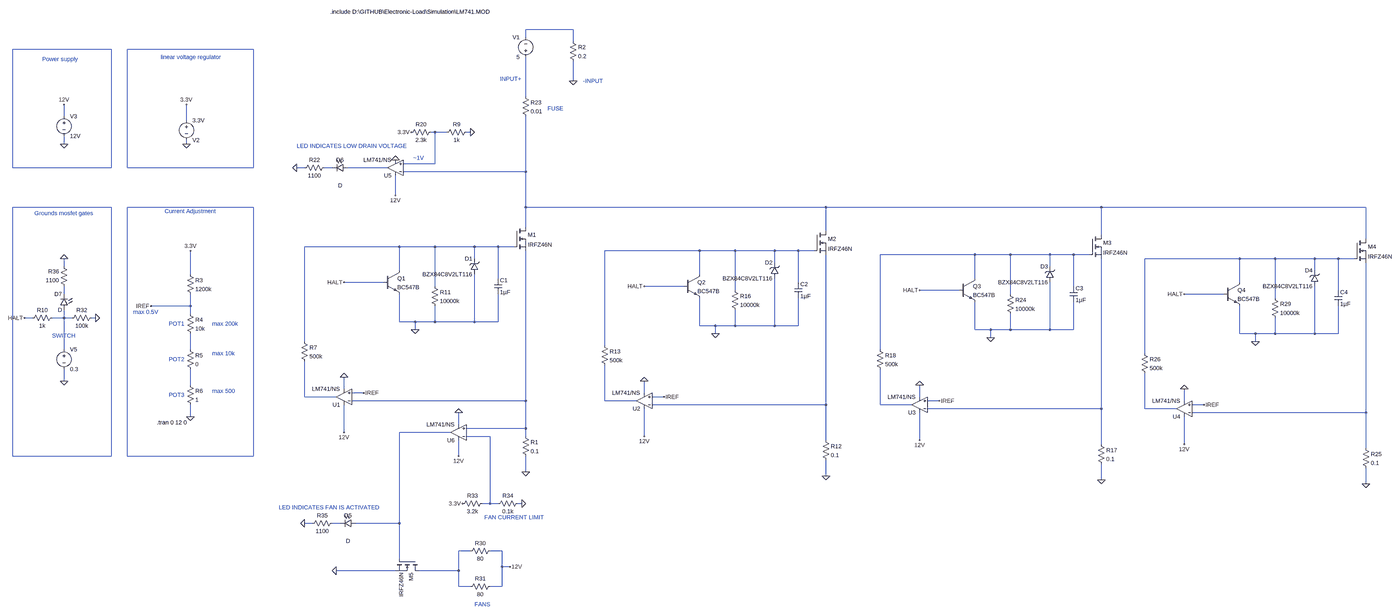
[diagram p0: schematic Simulation.asc, whole sheet]
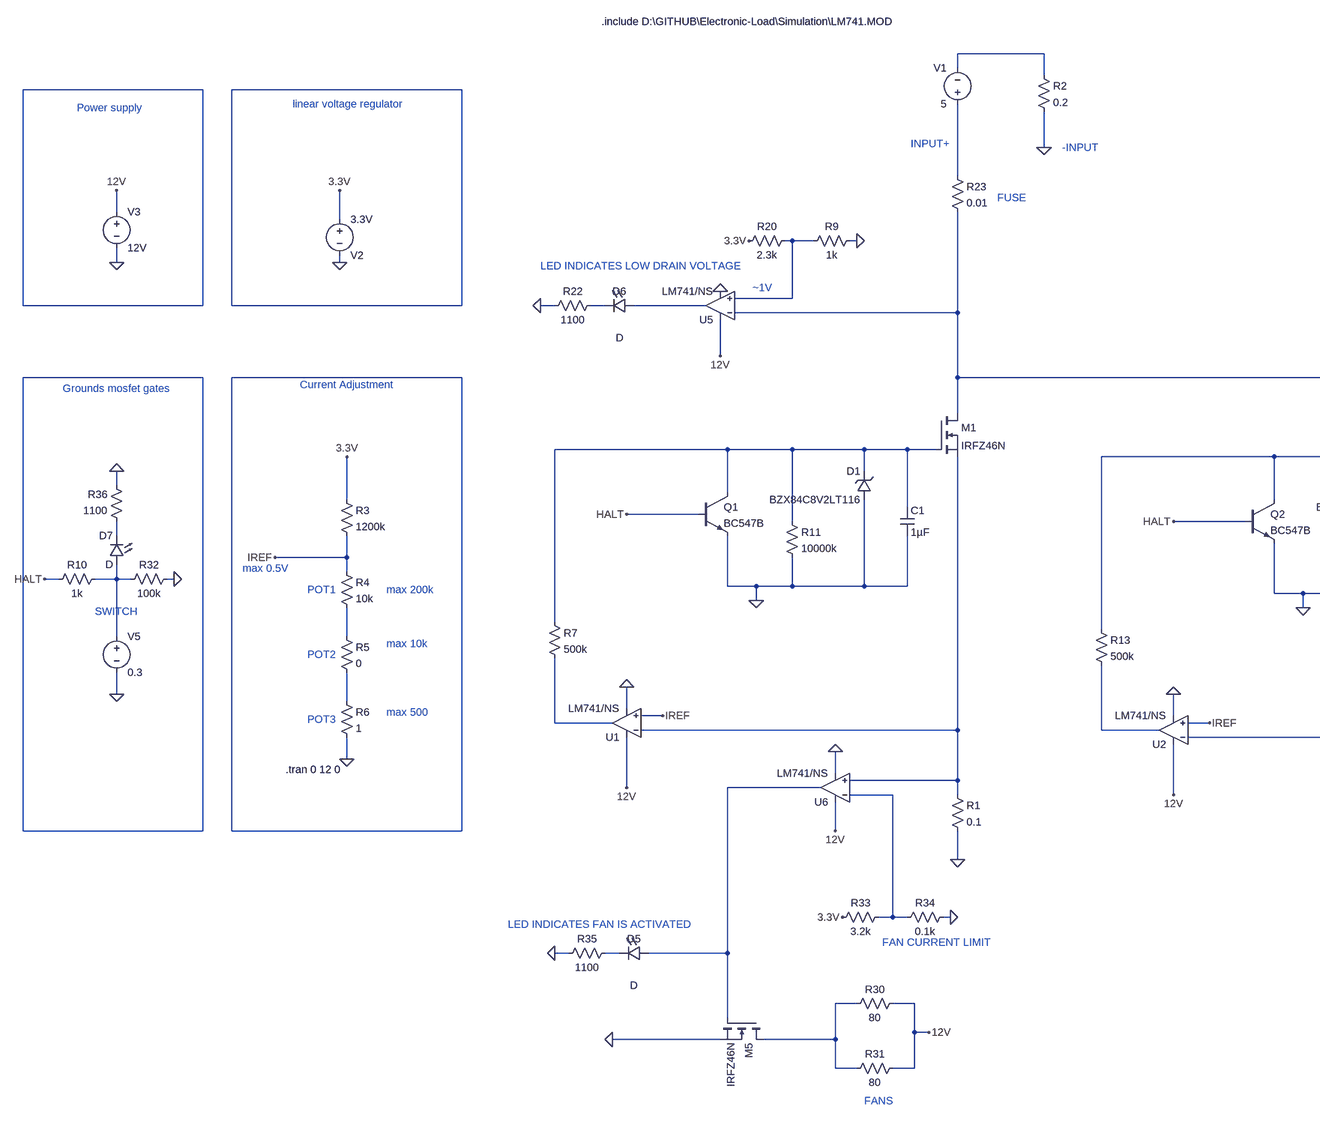
[diagram p1: schematic Simulation.asc, part, row 1 of 1, column 1 of 2]
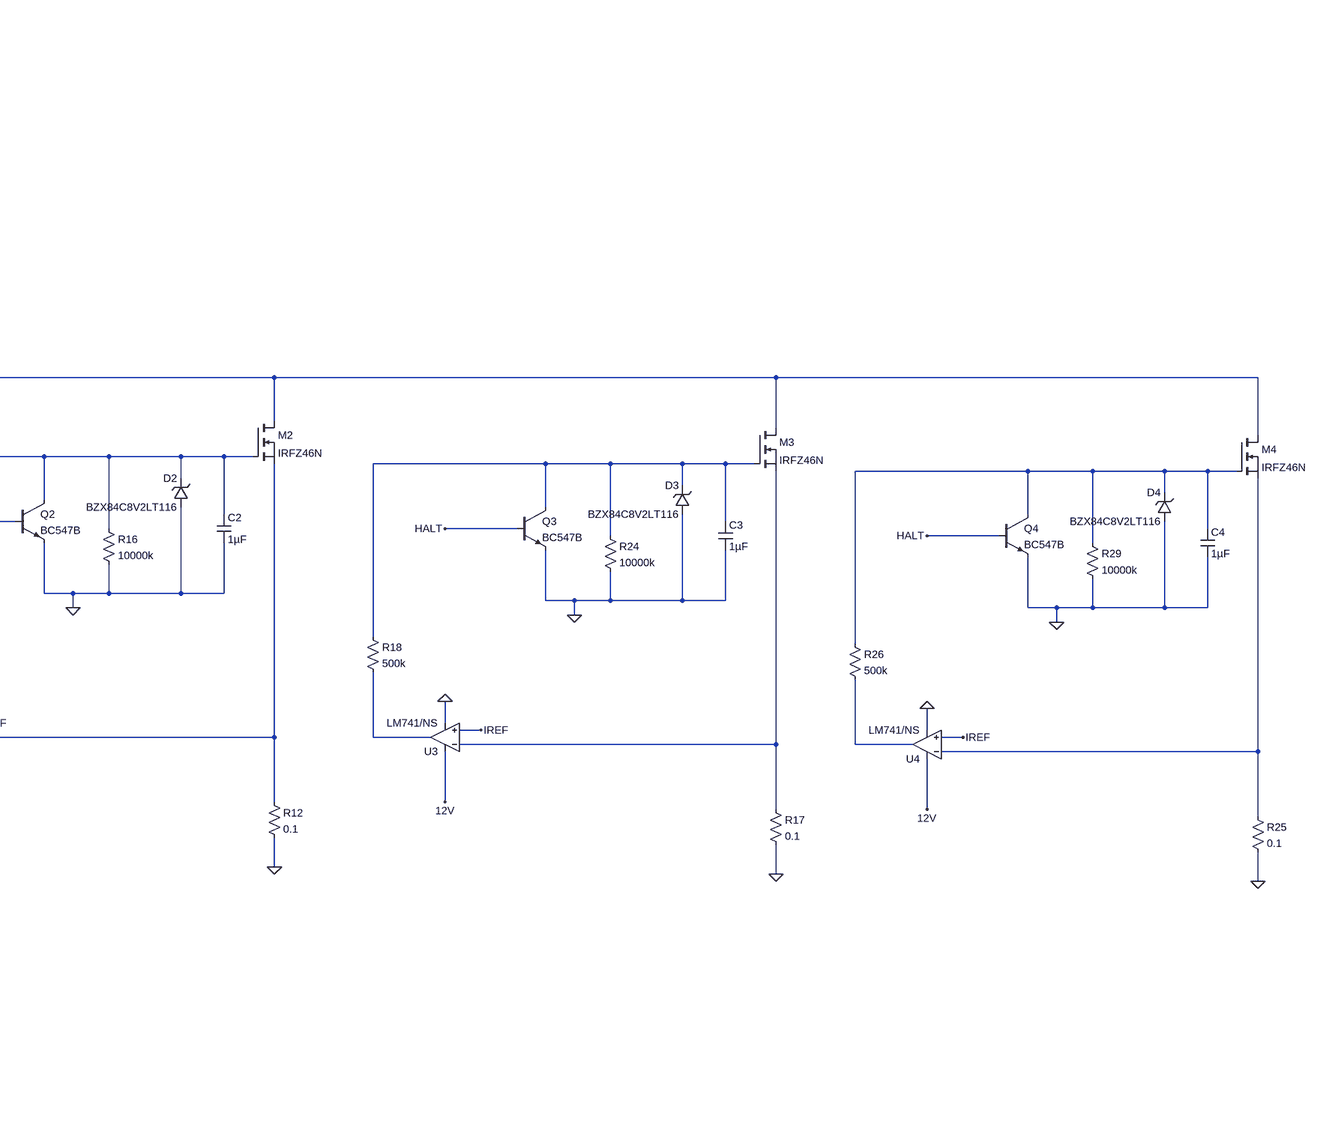
[diagram p2: schematic Simulation.asc, part, row 1 of 1, column 2 of 2]
Simulation.asc, the LTspice schematic file:
Version 4
SHEET 1 4272 2160
WIRE 912 -320 720 -320
WIRE 720 -288 720 -320
WIRE 912 -272 912 -320
WIRE -1360 -240 -1760 -240
WIRE -784 -240 -1296 -240
WIRE 912 -112 912 -192
WIRE 720 -48 720 -208
WIRE -1552 32 -1552 -16
WIRE -1056 48 -1056 -16
WIRE 352 96 336 96
WIRE 400 96 352 96
WIRE 496 96 480 96
WIRE -1552 144 -1552 112
WIRE -1056 144 -1056 128
WIRE 352 224 352 96
WIRE 352 224 224 224
WIRE -1760 240 -1760 -240
WIRE -1360 240 -1360 -240
WIRE -1360 240 -1760 240
WIRE -1296 240 -1296 -240
WIRE -784 240 -784 -240
WIRE -784 240 -1296 240
WIRE -176 240 -208 240
WIRE -64 240 -96 240
WIRE 160 240 0 240
WIRE 720 256 720 32
WIRE 720 256 224 256
WIRE 192 352 192 272
WIRE -1360 400 -1760 400
WIRE -784 400 -1296 400
WIRE 720 400 720 256
WIRE 1936 400 720 400
WIRE 3088 400 1936 400
WIRE 4160 400 3088 400
WIRE 720 480 720 400
WIRE 1936 496 1936 400
WIRE 3088 512 3088 400
WIRE 4160 528 4160 400
WIRE 208 560 -176 560
WIRE 352 560 208 560
WIRE 512 560 352 560
WIRE 608 560 512 560
WIRE 672 560 608 560
WIRE 1424 576 1040 576
WIRE 1568 576 1424 576
WIRE 1728 576 1568 576
WIRE 1824 576 1728 576
WIRE 1888 576 1824 576
WIRE 2576 592 2192 592
WIRE 2720 592 2576 592
WIRE 2880 592 2720 592
WIRE 2976 592 2880 592
WIRE 3040 592 2976 592
WIRE 512 608 512 560
WIRE 3648 608 3264 608
WIRE 3792 608 3648 608
WIRE 3952 608 3792 608
WIRE 4048 608 3952 608
WIRE 4112 608 4048 608
WIRE 1728 624 1728 576
WIRE -1552 640 -1552 608
WIRE 2880 640 2880 592
WIRE 208 656 208 560
WIRE 3952 656 3952 608
WIRE -1040 672 -1040 576
WIRE 1424 672 1424 576
WIRE 608 688 608 560
WIRE 2576 688 2576 592
WIRE 144 704 -16 704
WIRE 1824 704 1824 576
WIRE 3648 704 3648 608
WIRE 352 720 352 560
WIRE 1360 720 1200 720
WIRE 2976 720 2976 592
WIRE 1568 736 1568 576
WIRE 2512 736 2352 736
WIRE 4048 736 4048 608
WIRE -1552 752 -1552 720
WIRE 2720 752 2720 592
WIRE 3584 752 3424 752
WIRE 3792 768 3792 608
WIRE -1040 800 -1040 752
WIRE -1040 800 -1200 800
WIRE -1040 832 -1040 800
WIRE -1680 848 -1712 848
WIRE -1552 848 -1552 816
WIRE -1552 848 -1600 848
WIRE -1520 848 -1552 848
WIRE -1424 848 -1440 848
WIRE 208 864 208 752
WIRE 272 864 208 864
WIRE 352 864 352 800
WIRE 352 864 272 864
WIRE 512 864 512 672
WIRE 512 864 352 864
WIRE 608 864 608 752
WIRE 608 864 512 864
WIRE 1424 880 1424 768
WIRE 1488 880 1424 880
WIRE 1568 880 1568 816
WIRE 1568 880 1488 880
WIRE 1728 880 1728 688
WIRE 1728 880 1568 880
WIRE 1824 880 1824 768
WIRE 1824 880 1728 880
WIRE 272 896 272 864
WIRE 2576 896 2576 784
WIRE 2640 896 2576 896
WIRE 2720 896 2720 832
WIRE 2720 896 2640 896
WIRE 2880 896 2880 704
WIRE 2880 896 2720 896
WIRE 2976 896 2976 784
WIRE 2976 896 2880 896
WIRE 1488 912 1488 880
WIRE 3648 912 3648 800
WIRE 3712 912 3648 912
WIRE 3792 912 3792 848
WIRE 3792 912 3712 912
WIRE 3952 912 3952 720
WIRE 3952 912 3792 912
WIRE 4048 912 4048 800
WIRE 4048 912 3952 912
WIRE 2640 928 2640 896
WIRE -176 944 -176 560
WIRE 3712 944 3712 912
WIRE 1040 960 1040 576
WIRE -1552 976 -1552 848
WIRE -1040 976 -1040 912
WIRE 2192 976 2192 592
WIRE 3264 992 3264 608
WIRE -1552 1104 -1552 1056
WIRE -1040 1120 -1040 1056
WIRE -16 1136 -16 1088
WIRE 64 1152 16 1152
WIRE 1200 1152 1200 1104
WIRE -176 1168 -176 1024
WIRE -48 1168 -176 1168
WIRE 1280 1168 1232 1168
WIRE 2352 1168 2352 1120
WIRE 720 1184 720 576
WIRE 720 1184 16 1184
WIRE 1040 1184 1040 1040
WIRE 1168 1184 1040 1184
WIRE 2432 1184 2384 1184
WIRE 3424 1184 3424 1136
WIRE 1936 1200 1936 592
WIRE 1936 1200 1232 1200
WIRE 2192 1200 2192 1056
WIRE 2320 1200 2192 1200
WIRE 3504 1200 3456 1200
WIRE 3088 1216 3088 608
WIRE 3088 1216 2384 1216
WIRE 3264 1216 3264 1072
WIRE 3392 1216 3264 1216
WIRE 4160 1232 4160 624
WIRE 4160 1232 3456 1232
WIRE -1040 1248 -1040 1200
WIRE 448 1280 448 1232
WIRE 720 1296 720 1184
WIRE 720 1296 480 1296
WIRE -16 1312 -16 1200
WIRE 416 1312 208 1312
WIRE 576 1328 480 1328
WIRE 720 1328 720 1296
WIRE 1200 1328 1200 1216
WIRE 1936 1344 1936 1200
WIRE 2352 1344 2352 1232
WIRE 3088 1360 3088 1216
WIRE 3424 1360 3424 1248
WIRE 4160 1376 4160 1232
WIRE -1760 1408 -1760 400
WIRE -1360 1408 -1360 400
WIRE -1360 1408 -1760 1408
WIRE -1296 1408 -1296 400
WIRE -784 1408 -784 400
WIRE -784 1408 -1296 1408
WIRE 448 1408 448 1344
WIRE 720 1472 720 1408
WIRE 1936 1488 1936 1424
WIRE 3088 1504 3088 1440
WIRE 4160 1520 4160 1456
WIRE 576 1600 576 1328
WIRE 576 1600 544 1600
WIRE 608 1600 576 1600
WIRE 704 1600 688 1600
WIRE -144 1680 -176 1680
WIRE -32 1680 -64 1680
WIRE 208 1680 208 1312
WIRE 208 1680 32 1680
WIRE 496 1792 448 1792
WIRE 624 1792 576 1792
WIRE 208 1824 208 1680
WIRE 624 1856 624 1792
WIRE 656 1856 624 1856
WIRE 192 1872 -48 1872
WIRE 448 1872 448 1792
WIRE 448 1872 288 1872
WIRE 448 1936 448 1872
WIRE 496 1936 448 1936
WIRE 624 1936 624 1856
WIRE 624 1936 576 1936
FLAG -16 1088 0
FLAG 720 1472 0
FLAG 912 -112 0
FLAG -1200 800 IREF
FLAG 64 1152 IREF
FLAG -1056 144 0
FLAG -1040 1248 0
FLAG -1552 144 0
FLAG -1552 -16 12V
FLAG -16 1312 12V
FLAG 272 896 0
FLAG 192 208 0
FLAG 192 352 12V
FLAG -1056 -16 3.3V
FLAG 256 96 3.3V
FLAG -1040 576 3.3V
FLAG 496 96 0
FLAG -208 240 0
FLAG -16 704 HALT
FLAG -1712 848 HALT
FLAG 1200 1104 0
FLAG 1936 1488 0
FLAG 1280 1168 IREF
FLAG 1200 1328 12V
FLAG 1488 912 0
FLAG 1200 720 HALT
FLAG 2352 1120 0
FLAG 3088 1504 0
FLAG 2432 1184 IREF
FLAG 2352 1344 12V
FLAG 2640 928 0
FLAG 2352 736 HALT
FLAG 3424 1136 0
FLAG 4160 1520 0
FLAG 3504 1200 IREF
FLAG 3424 1360 12V
FLAG 3712 944 0
FLAG 3424 752 HALT
FLAG 448 1232 0
FLAG 448 1408 12V
FLAG 656 1856 12V
FLAG -48 1872 0
FLAG 464 1600 3.3V
FLAG 704 1600 0
FLAG -176 1680 0
FLAG -1552 1104 0
FLAG -1424 848 0
FLAG -1552 608 0
SYMBOL OpAmps\\opamp2 -16 1232 R180
SYMATTR InstName U1
SYMATTR Value LM741/NS
SYMBOL nmos 672 480 R0
SYMATTR InstName M1
SYMATTR Value IRFZ46N
SYMBOL res 704 1312 R0
SYMATTR InstName R1
SYMATTR Value 0.1
SYMBOL voltage 720 -192 R180
WINDOW 0 24 96 Left 2
WINDOW 3 24 16 Left 2
WINDOW 123 0 0 Left 0
WINDOW 39 0 0 Left 0
SYMATTR InstName V1
SYMATTR Value 5
SYMBOL zener 528 672 R180
WINDOW 0 24 64 Left 2
WINDOW 3 24 0 Left 2
SYMATTR InstName D1
SYMATTR Value BZX84C8V2LT116
SYMBOL res -1056 656 R0
SYMATTR InstName R3
SYMATTR Value 1200k
SYMBOL res -1056 816 R0
SYMATTR InstName R4
SYMATTR Value 10k
SYMBOL voltage -1056 32 R0
WINDOW 0 24 96 Left 2
WINDOW 3 24 16 Left 2
WINDOW 123 0 0 Left 0
WINDOW 39 0 0 Left 0
SYMATTR InstName V2
SYMATTR Value 3.3V
SYMBOL res -1056 960 R0
SYMATTR InstName R5
SYMATTR Value 0
SYMBOL res -1056 1104 R0
SYMATTR InstName R6
SYMATTR Value 1
SYMBOL voltage -1552 16 R0
WINDOW 123 0 0 Left 0
WINDOW 39 0 0 Left 0
SYMATTR InstName V3
SYMATTR Value 12V
SYMBOL res -192 928 R0
SYMATTR InstName R7
SYMATTR Value 500k
SYMBOL OpAmps\\opamp2 192 304 R180
SYMATTR InstName U5
SYMATTR Value LM741/NS
SYMBOL res 240 112 R270
WINDOW 0 32 56 VTop 2
WINDOW 3 0 56 VBottom 2
SYMATTR InstName R20
SYMATTR Value 2.3k
SYMBOL res -80 224 R90
WINDOW 0 0 56 VBottom 2
WINDOW 3 32 56 VTop 2
SYMATTR InstName R22
SYMATTR Value 1100
SYMBOL LED 0 224 R90
WINDOW 0 0 32 VBottom 2
WINDOW 3 72 32 VTop 2
SYMATTR InstName D6
SYMBOL res 704 -64 R0
SYMATTR InstName R23
SYMATTR Value 0.01
SYMBOL cap 592 688 R0
SYMATTR InstName C1
SYMATTR Value 1µF
SYMATTR SpiceLine IC=0
SYMBOL res 896 -288 R0
SYMATTR InstName R2
SYMATTR Value 0.2
SYMBOL res 496 80 R90
WINDOW 0 0 56 VBottom 2
WINDOW 3 32 56 VTop 2
SYMATTR InstName R9
SYMATTR Value 1k
SYMBOL npn 144 656 R0
SYMATTR InstName Q1
SYMATTR Value BC547B
SYMBOL res 336 704 R0
SYMATTR InstName R11
SYMATTR Value 10000k
SYMBOL OpAmps\\opamp2 1200 1248 R180
SYMATTR InstName U2
SYMATTR Value LM741/NS
SYMBOL nmos 1888 496 R0
SYMATTR InstName M2
SYMATTR Value IRFZ46N
SYMBOL res 1920 1328 R0
SYMATTR InstName R12
SYMATTR Value 0.1
SYMBOL zener 1744 688 R180
WINDOW 0 24 64 Left 2
WINDOW 3 24 0 Left 2
SYMATTR InstName D2
SYMATTR Value BZX84C8V2LT116
SYMBOL res 1024 944 R0
SYMATTR InstName R13
SYMATTR Value 500k
SYMBOL cap 1808 704 R0
SYMATTR InstName C2
SYMATTR Value 1µF
SYMBOL npn 1360 672 R0
SYMATTR InstName Q2
SYMATTR Value BC547B
SYMBOL res 1552 720 R0
SYMATTR InstName R16
SYMATTR Value 10000k
SYMBOL OpAmps\\opamp2 2352 1264 R180
SYMATTR InstName U3
SYMATTR Value LM741/NS
SYMBOL nmos 3040 512 R0
SYMATTR InstName M3
SYMATTR Value IRFZ46N
SYMBOL res 3072 1344 R0
SYMATTR InstName R17
SYMATTR Value 0.1
SYMBOL zener 2896 704 R180
WINDOW 0 24 64 Left 2
WINDOW 3 24 0 Left 2
SYMATTR InstName D3
SYMATTR Value BZX84C8V2LT116
SYMBOL res 2176 960 R0
SYMATTR InstName R18
SYMATTR Value 500k
SYMBOL cap 2960 720 R0
SYMATTR InstName C3
SYMATTR Value 1µF
SYMBOL npn 2512 688 R0
SYMATTR InstName Q3
SYMATTR Value BC547B
SYMBOL res 2704 736 R0
SYMATTR InstName R24
SYMATTR Value 10000k
SYMBOL OpAmps\\opamp2 3424 1280 R180
SYMATTR InstName U4
SYMATTR Value LM741/NS
SYMBOL nmos 4112 528 R0
SYMATTR InstName M4
SYMATTR Value IRFZ46N
SYMBOL res 4144 1360 R0
SYMATTR InstName R25
SYMATTR Value 0.1
SYMBOL zener 3968 720 R180
WINDOW 0 24 64 Left 2
WINDOW 3 24 0 Left 2
SYMATTR InstName D4
SYMATTR Value BZX84C8V2LT116
SYMBOL res 3248 976 R0
SYMATTR InstName R26
SYMATTR Value 500k
SYMBOL cap 4032 736 R0
SYMATTR InstName C4
SYMATTR Value 1µF
SYMBOL npn 3584 704 R0
SYMATTR InstName Q4
SYMATTR Value BC547B
SYMBOL res 3776 752 R0
SYMATTR InstName R29
SYMATTR Value 10000k
SYMBOL res 592 1776 R90
WINDOW 0 0 56 VBottom 2
WINDOW 3 32 56 VTop 2
SYMATTR InstName R30
SYMATTR Value 80
SYMBOL res 592 1920 R90
WINDOW 0 0 56 VBottom 2
WINDOW 3 32 56 VTop 2
SYMATTR InstName R31
SYMATTR Value 80
SYMBOL OpAmps\\opamp2 448 1376 R180
SYMATTR InstName U6
SYMATTR Value LM741/NS
SYMBOL res 448 1616 R270
WINDOW 0 32 56 VTop 2
WINDOW 3 0 56 VBottom 2
SYMATTR InstName R33
SYMATTR Value 3.2k
SYMBOL res 704 1584 R90
WINDOW 0 0 56 VBottom 2
WINDOW 3 32 56 VTop 2
SYMATTR InstName R34
SYMATTR Value 0.1k
SYMBOL nmos 288 1824 R90
SYMATTR InstName M5
SYMATTR Value IRFZ46N
SYMBOL res -48 1664 R90
WINDOW 0 0 56 VBottom 2
WINDOW 3 32 56 VTop 2
SYMATTR InstName R35
SYMATTR Value 1100
SYMBOL LED 32 1664 R90
WINDOW 0 0 32 VBottom 2
WINDOW 3 72 32 VTop 2
SYMATTR InstName D5
SYMBOL voltage -1552 960 R0
WINDOW 123 0 0 Left 0
WINDOW 39 0 0 Left 0
SYMATTR InstName V5
SYMATTR Value 0.3
SYMBOL res -1424 832 R90
WINDOW 0 0 56 VBottom 2
WINDOW 3 32 56 VTop 2
SYMATTR InstName R32
SYMATTR Value 100k
SYMBOL res -1536 736 R180
WINDOW 0 36 76 Left 2
WINDOW 3 36 40 Left 2
SYMATTR InstName R36
SYMATTR Value 1100
SYMBOL LED -1536 816 R180
WINDOW 0 24 64 Left 2
WINDOW 3 24 0 Left 2
SYMATTR InstName D7
SYMBOL res -1584 832 R90
WINDOW 0 0 56 VBottom 2
WINDOW 3 32 56 VTop 2
SYMATTR InstName R10
SYMATTR Value 1k
TEXT -72 -392 Left 2 !.include D:\\GITHUB\\Electronic-Load\\Simulation\\LM741.MOD
TEXT 616 -120 Left 2 ;INPUT+
TEXT 952 -112 Left 2 ;-INPUT
TEXT -1272 824 Left 2 ;max 0.5V
TEXT -952 872 Left 2 ;max 200k
TEXT -952 992 Left 2 ;max 10k
TEXT -952 1144 Left 2 ;max 500
TEXT -1176 1272 Left 2 !.tran 0 12 0
TEXT -1144 416 Left 2 ;Current Adjustment
TEXT 264 200 Left 2 ;~1V
TEXT -208 152 Left 2 ;LED INDICATES LOW DRAIN VOLTAGE
TEXT 808 0 Left 2 ;FUSE
TEXT -280 1616 Left 2 ;LED INDICATES FAN IS ACTIVATED
TEXT -1672 424 Left 2 ;Grounds mosfet gates
TEXT -1128 872 Left 2 ;POT1
TEXT -1128 1016 Left 2 ;POT2
TEXT -1128 1160 Left 2 ;POT3
TEXT -1600 920 Left 2 ;SWITCH
TEXT 552 1656 Left 2 ;FAN CURRENT LIMIT
TEXT -1640 -200 Left 2 ;Power supply
TEXT -1160 -208 Left 2 ;linear voltage regulator
TEXT 512 2008 Left 2 ;FANS

The netlist it stands for:
* Simulation.asc
XU1 IREF N020 12V 0 N019 LM741/NS  ; pins In+ In- V+ V- OUT
M1 N008 N011 N020 N020 IRFZ46N
R1 N020 0 0.1
V1 N004 N001 5
D1 0 N011 BZX84C8V2LT116
R3 3.3V IREF 1200k
R4 IREF N017 10k
V2 3.3V 0 3.3V
R5 N017 N018 0
R6 N018 0 1
V3 12V 0 12V
R7 N011 N019 500k
XU5 N005 N008 12V 0 N007 LM741/NS  ; pins In+ In- V+ V- OUT
R20 3.3V N005 2.3k
R22 N006 0 1100
D6 N007 N006 D
R23 N004 N008 0.01
C1 N011 0 1µF IC=0
R2 N001 0 0.2
R9 0 N005 1k
Q1 N011 HALT 0 0 BC547B
R11 N011 0 10000k
XU2 IREF N022 12V 0 N021 LM741/NS  ; pins In+ In- V+ V- OUT
M2 N008 N012 N022 N022 IRFZ46N
R12 N022 0 0.1
D2 0 N012 BZX84C8V2LT116
R13 N012 N021 500k
C2 N012 0 1µF
Q2 N012 HALT 0 0 BC547B
R16 N012 0 10000k
XU3 IREF N024 12V 0 N023 LM741/NS  ; pins In+ In- V+ V- OUT
M3 N008 N013 N024 N024 IRFZ46N
R17 N024 0 0.1
D3 0 N013 BZX84C8V2LT116
R18 N013 N023 500k
C3 N013 0 1µF
Q3 N013 HALT 0 0 BC547B
R24 N013 0 10000k
XU4 IREF N026 12V 0 N025 LM741/NS  ; pins In+ In- V+ V- OUT
M4 N008 N014 N026 N026 IRFZ46N
R25 N026 0 0.1
D4 0 N014 BZX84C8V2LT116
R26 N014 N025 500k
C4 N014 0 1µF
Q4 N014 HALT 0 0 BC547B
R29 N014 0 10000k
R30 12V N030 80
R31 12V N030 80
XU6 N020 N028 12V 0 N027 LM741/NS  ; pins In+ In- V+ V- OUT
R33 3.3V N028 3.2k
R34 0 N028 0.1k
M5 N030 N027 0 0 IRFZ46N
R35 N029 0 1100
D5 N027 N029 D
V5 N016 0 0.3
R32 0 N016 100k
R36 N015 0 1100
D7 N016 N015 D
R10 N016 HALT 1k
.model D D
.lib standard.dio
.model NPN NPN
.model PNP PNP
.lib standard.bjt
.model NMOS NMOS
.model PMOS PMOS
.lib standard.mos
.include D:\GITHUB\Electronic-Load\Simulation\LM741.MOD
* INPUT+
* -INPUT
* max 0.5V
* max 200k
* max 10k
* max 500
.tran 0 12 0
* Current Adjustment
* ~1V
* LED INDICATES LOW DRAIN VOLTAGE
* FUSE
* LED INDICATES FAN IS ACTIVATED
* Grounds mosfet gates
* POT1
* POT2
* POT3
* SWITCH
* FAN CURRENT LIMIT
* Power supply
* linear voltage regulator
* FANS
.backanno
.end